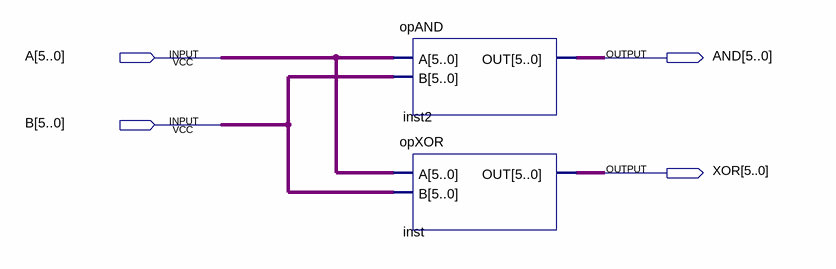
[diagram p0: schematic sheet]
// Quartus schematic UnidadeANDXOR.bdf as structural Verilog: 2 symbols, 4 pins
module UnidadeANDXOR (
  input  [5:0] A,
  input  [5:0] B,
  output [5:0] AND,
  output [5:0] XOR
);

  opAND inst2 (.A(A), .B(B), .OUT(AND));
  opXOR inst (.A(A), .B(B), .OUT(XOR));
endmodule
